# Altium schematic sheet PCI-connector.SchDoc
size A
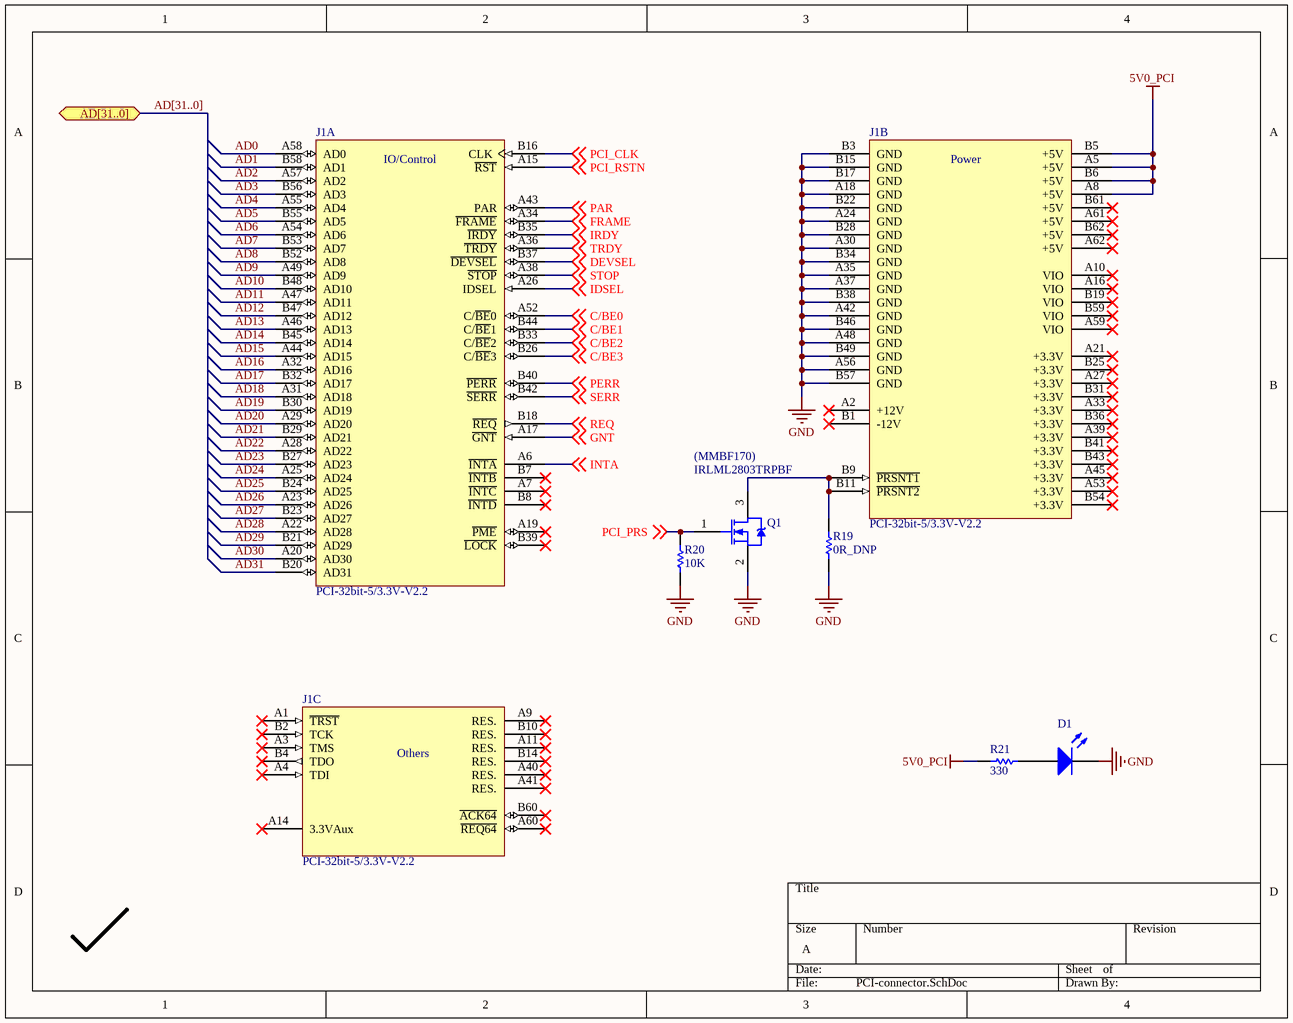
[diagram p0: PCI-connector.SchDoc]

## Parts
D1  LED0  [C0805]  (value not drawn)
J1  PCI-32bit-5/3.3V-V2.2  [PCI-32bit-5/3.3V-V2.2]  (parts A,B,C of 3)
Q1  IRLML2803TRPBF  [SOT23]
R19  value 0R_DNP  [0603PKG]  (hidden comment: Res Semi)
R20  value 10K  [0603PKG]  (hidden comment: Res Semi)
R21  value 330  [0603PKG]  (hidden comment: Res Semi)

## Ports
AD[31..0]

## Nets
5V0_PCI: J1.A5(+5V) J1.A8(+5V) J1.B5(+5V) J1.B6(+5V) R21.2
GND: D1.2(K) J1.A18(GND) J1.A24(GND) J1.A30(GND) J1.A35(GND) J1.A37(GND) J1.A42(GND) J1.A48(GND) J1.A56(GND) J1.B3(GND) J1.B15(GND) J1.B17(GND) J1.B22(GND) J1.B28(GND) J1.B34(GND) J1.B38(GND) J1.B46(GND) J1.B49(GND) J1.B57(GND) Q1.2(S) R19.2 R20.2
AD0: J1.A58(AD0)
AD1: J1.B58(AD1)
AD2: J1.A57(AD2)
AD3: J1.B56(AD3)
AD4: J1.A55(AD4)
AD5: J1.B55(AD5)
AD6: J1.A54(AD6)
AD7: J1.B53(AD7)
AD8: J1.B52(AD8)
AD9: J1.A49(AD9)
AD10: J1.B48(AD10)
AD11: J1.A47(AD11)
AD12: J1.B47(AD12)
AD13: J1.A46(AD13)
AD14: J1.B45(AD14)
AD15: J1.A44(AD15)
AD16: J1.A32(AD16)
AD17: J1.B32(AD17)
AD18: J1.A31(AD18)
AD19: J1.B30(AD19)
AD20: J1.A29(AD20)
AD21: J1.B29(AD21)
AD22: J1.A28(AD22)
AD23: J1.B27(AD23)
AD24: J1.A25(AD24)
AD25: J1.B24(AD25)
AD26: J1.A23(AD26)
AD27: J1.B23(AD27)
AD28: J1.A22(AD28)
AD29: J1.B21(AD29)
AD30: J1.A20(AD30)
AD31: J1.B20(AD31)
C/BE0: J1.A52(C/~{BE}0) ; off-sheet C/BE0
C/BE1: J1.B44(C/~{BE}1) ; off-sheet C/BE1
C/BE2: J1.B33(C/~{BE}2) ; off-sheet C/BE2
C/BE3: J1.B26(C/~{BE}3) ; off-sheet C/BE3
DEVSEL: J1.B37(~{DEVSEL}) ; off-sheet DEVSEL
FRAME: J1.A34(~{FRAME}) ; off-sheet FRAME
GNT: J1.A17(~{GNT}) ; off-sheet GNT
IDSEL: J1.A26(IDSEL) ; off-sheet IDSEL
INTA: J1.A6(~{INTA}) ; off-sheet INTA
IRDY: J1.B35(~{IRDY}) ; off-sheet IRDY
PAR: J1.A43(PAR) ; off-sheet PAR
PCI_CLK: J1.B16(CLK) ; off-sheet PCI_CLK
PCI_PRS: Q1.1(G) R20.1 ; off-sheet PCI_PRS
PCI_RSTN: J1.A15(~{RST}) ; off-sheet PCI_RSTN
PERR: J1.B40(~{PERR}) ; off-sheet PERR
REQ: J1.B18(~{REQ}) ; off-sheet REQ
SERR: J1.B42(~{SERR}) ; off-sheet SERR
STOP: J1.A38(~{STOP}) ; off-sheet STOP
TRDY: J1.A36(~{TRDY}) ; off-sheet TRDY
NetD1_1: D1.1(A) R21.1
NetJ1_B9: J1.B9(~{PRSNT1}) J1.B11(~{PRSNT2}) Q1.3(D) R19.1

Not connected (* = marked no-connect by the designer): J1 A1(~{TRST})* A2(+12V)* A3(TMS)* A4(TDI)* A7(~{INTC})* A9(RES.)* A10(VIO)* A11(RES.)* A14(3.3VAux)* A16(VIO)* A19(~{PME})* A21(+3.3V)* A27(+3.3V)* A33(+3.3V)* A39(+3.3V)* A40(RES.)* A41(RES.)* A45(+3.3V)* A53(+3.3V)* A59(VIO)* A60(~{REQ64})* A61(+5V)* A62(+5V)* B1(-12V)* B2(TCK)* B4(TDO)* B7(~{INTB})* B8(~{INTD})* B10(RES.)* B14(RES.)* B19(VIO)* B25(+3.3V)* B31(+3.3V)* B36(+3.3V)* B39(~{LOCK})* B41(+3.3V)* B43(+3.3V)* B54(+3.3V)* B59(VIO)* B60(~{ACK64})* B61(+5V)* B62(+5V)*

## Buses and harness runs
bus AD[31..0] = port AD[31..0]

## Notes on the sheet
- (MMBF170)
- (in symbol PCI-32bit-5/3.3V-V2.2, part A) IO/Control
- (in symbol PCI-32bit-5/3.3V-V2.2, part B) Power
- (in symbol PCI-32bit-5/3.3V-V2.2, part C) Others

## Library data of the parts
D1 = LED0: Typical INFRARED GaAs LED; Published: 8-Jun-2000; LatestRevisionDate: 08-Jul-2005; LatestRevisionNote: Mech Layer 1 removed.; PackageReference: LED-0; Publisher: Altium Limited; PackageDescription: LED; 2 Leads
Q1 = NMOS-2: N-Channel Power MOSFET; Note: Pin 2 is electrically connected to pin 4.; Published: 8-Jun-2000; LatestRevisionDate: 17-Jul-2002; LatestRevisionNote: Re-released for DXP Platform.; DatasheetVersion: PD-9.814; PackageVersion: Feb-1997; PackageReference: TO-220AB; Publisher: Altium Limited; PackageDescription: TO, Thru-Hole, Vertical, Heatsink Mounted; 3 In-Line Leads; Pitch 2.54 mm; ComponentLink1Description: Manufacturer Link; ComponentLink1URL: http://www.irf.com/
R19-R21 = Res Semi: Semiconductor Resistor; Published: 8-Jun-2000; LatestRevisionDate: 17-Jul-2002; LatestRevisionNote: Re-released for DXP Platform.; PackageReference: AXIAL-0.5; Publisher: Altium Limited; PackageDescription: Axial Device, Thru-Hole; 2 Leads; 0.5 in Pin Spacing